# EAGLE design amiketo (EAGLE 7.2.0)
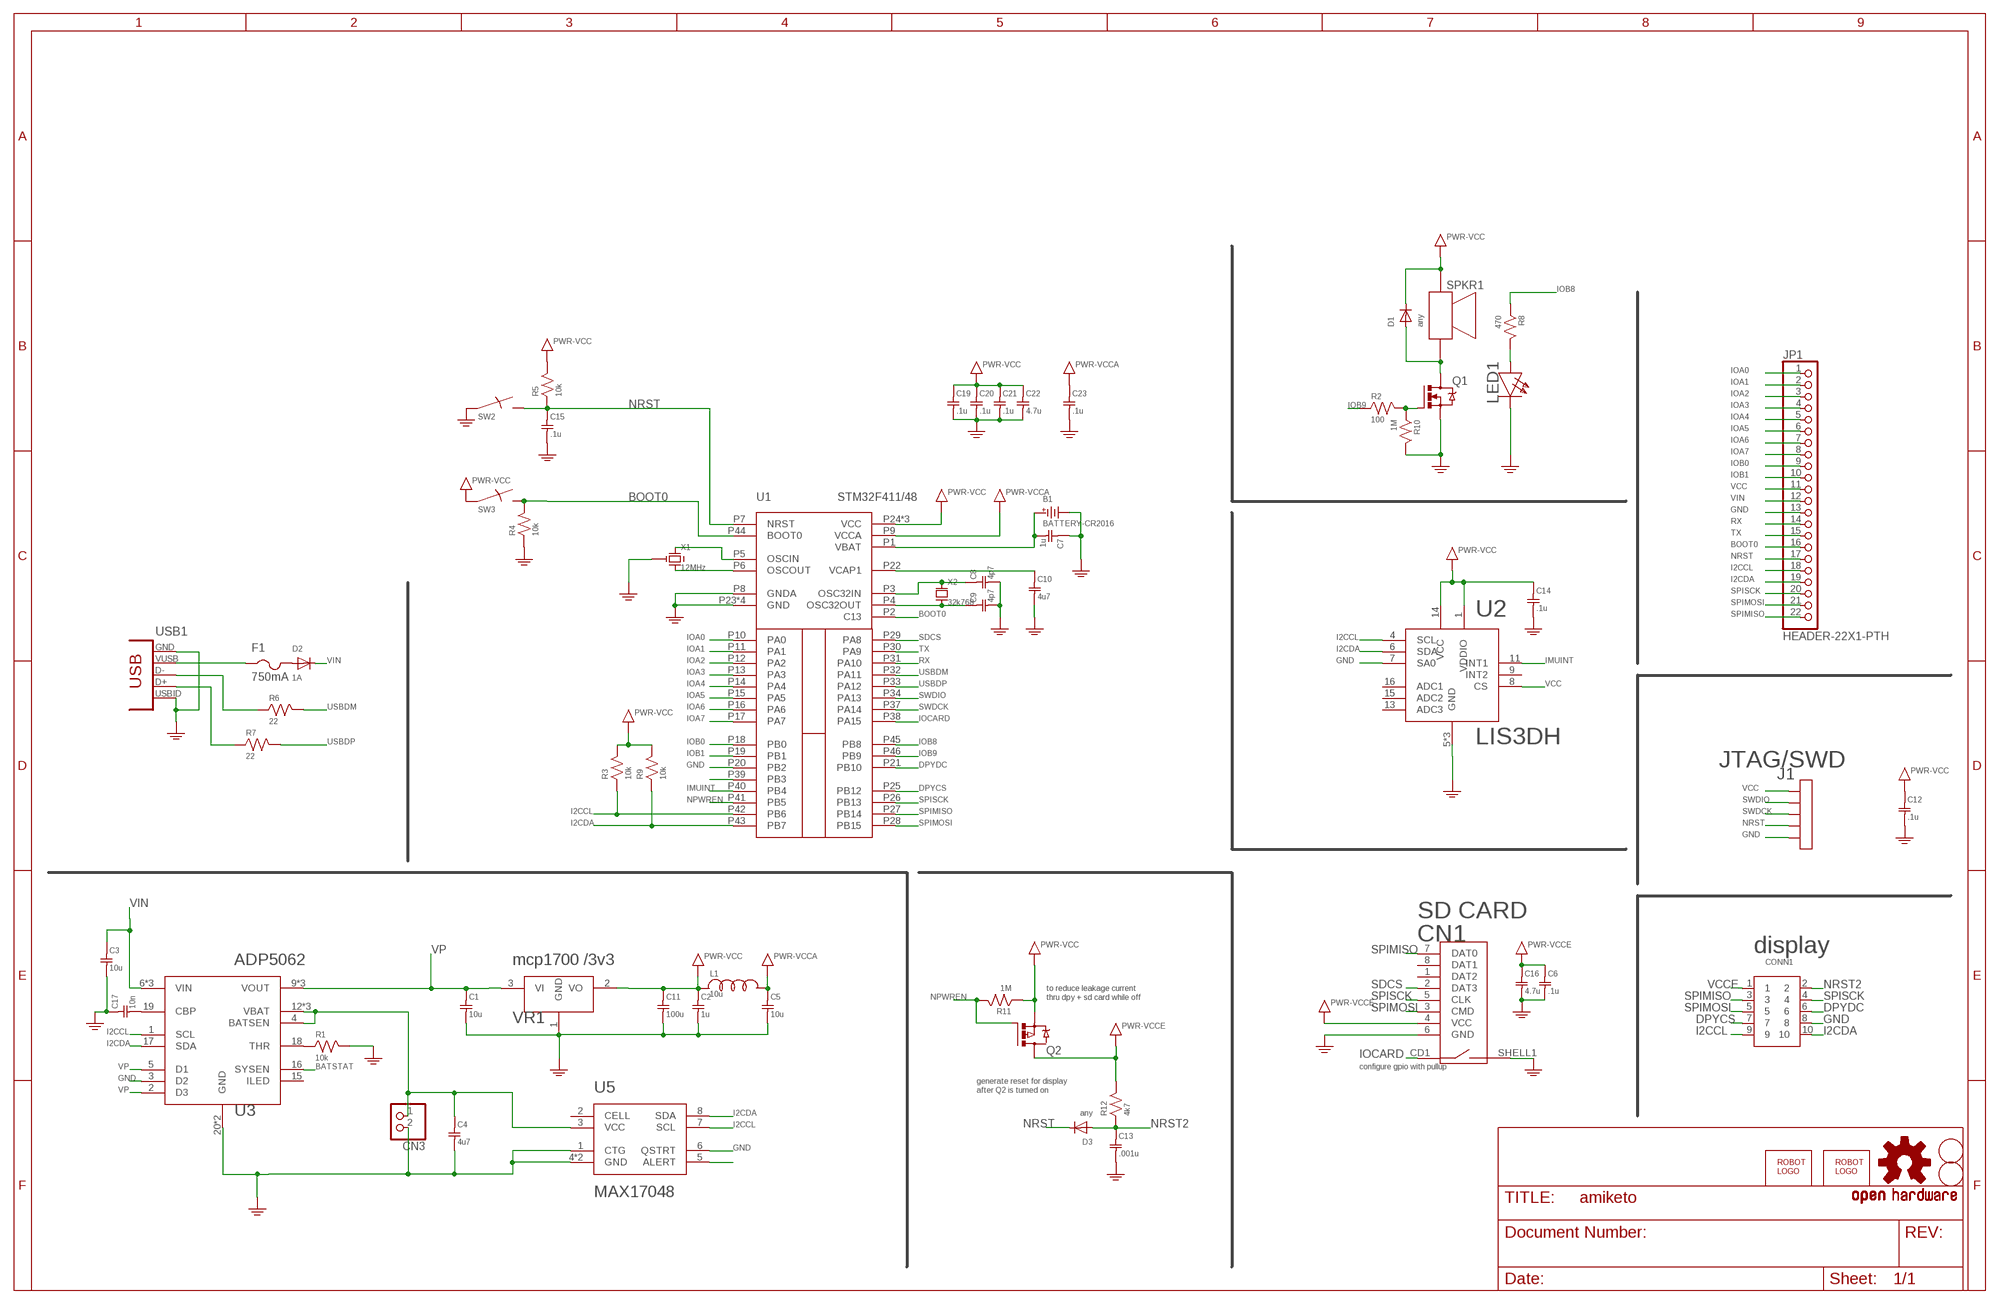
[diagram p0: schematic, sheet 1]

## Parts
B1  BATTERY-CR2016  [CR1216]
C1  10u  C0603  [SMD0603]
C2  1u  C0603  [SMD0603]
C3  10u  C0603  [SMD0603]
C4  4u7  C0603  [SMD0603]
C5  10u  C0603  [SMD0603]
C6  .1u  C0603  [SMD0603]
C7  1u  C0603  [SMD0603]
C8  4p7  C0603  [SMD0603]
C9  4p7  C0603  [SMD0603]
C10  4u7  C0603  [SMD0603]
C11  100u  C1210  [SMD1210]
C12  .1u  C0603  [SMD0603]
C13  .001u  C0603  [SMD0603]
C14  .1u  C0603  [SMD0603]
C15  .1u  C0603  [SMD0603]
C16  4.7u  C0603  [SMD0603]
C17  10n  C0603  [SMD0603]
C19  .1u  C0603  [SMD0603]
C20  .1u  C0603  [SMD0603]
C21  .1u  C0603  [SMD0603]
C22  4.7u  C0603  [SMD0603]
C23  .1u  C0603  [SMD0603]
CN1  MICROSD-EJECT  [MICROSD/EJECTOR]
CN3  JST_2PIN-SMT-RA  [JST-PH-2-SMT-RA]
CONN1  HEADER-5X2-PTH  [HEADER-5X2-PTH]
D1  any  DIODESOD-323  [SOD-323]
D2  1A  DIODE-0805  [SMD0805D]
D3  any  DIODESOD-323  [SOD-323]
F1  750mA  FUSE  [SMD1206]
J1  HEADER-5X1  [HEADER-5X1-SMD127-NOCR]
JP1  HEADER-22X1-PTH  [HEADER-22X1-PTH]
L1  10u  LSMD0603  [SMD0603]
LED1  white  LED  [SMD0603D]
LOGO1  OSHW-LOGOM  [OSHW-LOGO-M]
Q1  IRLML6344TRPBF  MOSFETSOT-23  [SOT-23]
Q2  DMP2035U-7  MOSFET-P  [SOT-23]
R1  10k  R0603  [SMD0603]
R2  100  R0603  [SMD0603]
R3  10k  R0603  [SMD0603]
R4  10k  R0603  [SMD0603]
R5  10k  R0603  [SMD0603]
R6  22  R0603  [SMD0603]
R7  22  R0603  [SMD0603]
R8  470  R0603  [SMD0603]
R9  10k  R0603  [SMD0603]
R10  1M  R0603  [SMD0603]
R11  1M  R0603  [SMD0603]
R12  4k7  R0603  [SMD0603]
SPKR1  PUI-5040  [PUI-0540]
SW2  SWITCHKMR211  [KMR211]
SW3  SWITCHKMR211  [KMR211]
U1  STM32F411/48  [UQPFN48]
U2  LIS3DH  [LGA16A]
U3  ADP5062  [LGA20P]
U5  MAX17048  [TDFN8EP]
U$1  ROBOTMAN-LOGO2  [ROBOTMAN-LOGO2]
U$2  FIDUCIAL  [FIDUCIAL_1MM]
U$3  FIDUCIAL  [FIDUCIAL_1MM]
U$4  ROBOTMAN-LOGO2  [ROBOTMAN-LOGO2]
USB1  CON-USB-F-MICRO-B  [CONN_USB_MICRO-B]
VR1  mcp1700 /3v3  REGULATOR-SOT23-3  [SOT-23-3]
X1  12MHz  RESONATORCTCE  [RESONATOR-CSTCE]
X2  32k768  XTAL32X15  [XTAL-32X15]

## Nets
BATSTAT: U3.16(SYSEN)
BOOT0: JP1.16 R4.2 SW3.2 SW3.4 U1.P2(C13) U1.P44(BOOT0)
DPYCS: CONN1.7 U1.P25(PB12)
DPYDC: CONN1.6 U1.P21(PB10)
GND: B1.MINUS(M) C1.2 C2.2 C3.2 C4.2 C5.2 C6.2 C7.1 C8.2 C9.2 C10.2 C11.2 C12.2 C13.2 C14.2 C15.2 C16.2 C17.1 C19.2 C20.2 C21.2 C22.2 C23.2 CN1.6(GND) CN1.SHELL1(SW2) CN3.2 CONN1.8 J1.P$5 JP1.13 LED1.C Q1.2(S) R1.2 R4.1 R10.2 SW2.1 SW2.3 U1.P8(GNDA) U1.P20(PB2) U1.P23(GND) U1.P35(GND) U1.P47(GND) U1.PAD(GND) U2.5(GND) U2.7(SA0) U2.10(GND) U2.12(GND) U3.3(D2) U3.20(GND) U3.PAD(GND) U5.1(CTG) U5.4(GND) U5.6(QSTRT) U5.PAD(GND) USB1.P4(USBID) USB1.P5(GND) VR1.1(GND) X1.2(G) ; supply symbol labelled PWR-GND
I2CCL: CONN1.9 JP1.18 R3.1 U1.P42(PB6) U2.4(SCL) U3.1(SCL) U5.7(SCL)
I2CDA: CONN1.10 JP1.19 R9.1 U1.P43(PB7) U2.6(SDA) U3.17(SDA) U5.8(SDA)
IMUINT: U1.P40(PB4) U2.11(INT1)
IOA0: JP1.1 U1.P10(PA0)
IOA1: JP1.2 U1.P11(PA1)
IOA2: JP1.3 U1.P12(PA2)
IOA3: JP1.4 U1.P13(PA3)
IOA4: JP1.5 U1.P14(PA4)
IOA5: JP1.6 U1.P15(PA5)
IOA6: JP1.7 U1.P16(PA6)
IOA7: JP1.8 U1.P17(PA7)
IOB0: JP1.9 U1.P18(PB0)
IOB1: JP1.10 U1.P19(PB1)
IOB8: R8.1 U1.P45(PB8)
IOB9: R2.1 U1.P46(PB9)
IOCARD: CN1.CD1(SW1) U1.P38(PA15)
N$3: F1.1 USB1.P1(VUSB)
N$5: C17.2 U3.19(CBP)
N$6: R1.1 U3.18(THR)
N$7: R6.1 USB1.P2(D-)
N$8: R7.1 USB1.P3(D+)
N$9: Q1.1(G) R2.2 R10.1
N$11: LED1.A R8.2
N$12: U1.P5(OSCIN) X1.1(X1)
N$13: U1.P6(OSCOUT) X1.3(X2)
N$14: D1.A Q1.3(D) SPKR1.P2
N$15: C8.1 U1.P3(OSC32IN) X2.P$1
N$16: C9.1 U1.P4(OSC32OUT) X2.P$2
N$18: C10.1 U1.P22(VCAP1)
N$21: B1.PLUS1(P) B1.PLUS2(P) C7.2 U1.P1(VBAT)
N$22: U5.5(ALERT)
N$24: D2.A F1.2
NPWREN: Q2.1(G) R11.2 U1.P41(PB5)
NRST: C15.1 D3.C J1.P$4 JP1.17 R5.1 SW2.2 SW2.4 U1.P7(NRST)
NRST2: C13.1 CONN1.2 D3.A R12.1
RX: JP1.14 U1.P31(PA10)
SDCS: CN1.2(DAT3) U1.P29(PA8)
SPIMISO: CN1.7(DAT0) CONN1.3 JP1.22 U1.P27(PB14)
SPIMOSI: CN1.3(CMD) CONN1.5 JP1.21 U1.P28(PB15)
SPISCK: CN1.5(CLK) CONN1.4 JP1.20 U1.P26(PB13)
SWDCK: J1.P$3 U1.P37(PA14)
SWDIO: J1.P$2 U1.P34(PA13)
SWDWO: U1.P39(PB3)
TX: JP1.15 U1.P30(PA9)
USBDM: R6.2 U1.P32(PA11)
USBDP: R7.2 U1.P33(PA12)
VBAT: C4.1 CN3.1 U3.4(BATSEN) U3.12(VBAT) U3.13(VBAT) U3.14(VBAT) U5.3(VCC)
VCC: C2.1 C11.1 C12.1 C14.1 C19.1 C20.1 C21.1 C22.1 D1.C J1.P$1 JP1.11 L1.1 Q2.2(S) R3.2 R5.2 R9.2 R11.1 SPKR1.P1 SW3.1 SW3.3 U1.P24(VCC) U1.P36(VCC) U1.P48(VCC) U2.1(VDDIO) U2.8(CS) U2.14(VCC) VR1.2(VO) ; supply symbol labelled PWR-VCC
VCCA: C5.1 C23.1 L1.2 U1.P9(VCCA) ; supply symbol labelled PWR-VCCA
VCCE: C6.1 C16.1 CN1.4(VCC) CONN1.1 Q2.3(D) R12.2 ; supply symbol labelled PWR-VCCE
VIN: C3.1 D2.C JP1.12 U3.6(VIN) U3.7(VIN) U3.8(VIN)
VP: C1.1 U3.2(D3) U3.5(D1) U3.9(VOUT) U3.10(VOUT) U3.11(VOUT) VR1.3(VI)
Unconnected: CN1.1(DAT2) CN1.8(DAT1) U2.9(INT2) U2.13(ADC3) U2.15(ADC2) U2.16(ADC1) U3.15(ILED) U5.2(CELL) USB1.BODY@1(BODY) USB1.BODY@2(BODY) USB1.BODY@3(BODY) USB1.BODY@4(BODY)

## Notes on the sheet
- JTAG/SWD
- SD CARD
- display
- to reduce leakage current
  thru dpy + sd card while off
- configure gpio with pullup
- generate reset for display
  after Q2 is turned on

## Library data of the parts
B1 = jaw:BATTERY
C1-C17 C19-C23 = jaw:C
CN1 = jaw:MICROSD
CN3 = adafruit:JST_2PIN: JST 2-Pin Connectors of various flavors SMT-RA (S2B-PH-SM4) 4UConnector #17311 SMT (B2B-PH-SM4) THM-RA (S2B-PH) THM (B2B-PH)
CONN1 = jaw:HEADER-5X2
D1-D3 = jaw:DIODE
F1 = jaw:FUSE
J1 = jaw:HEADER-5X1
JP1 = jaw:HEADER-22X1
L1 = jaw:L
LED1 = jaw:LED
LOGO1 = Sparkfun-Aesthetics:OSHW-LOGO: Open Source Hardware Logo This logo indicates the piece of hardware it is found on incorporates a OSHW license and/or adheres to the definition of open source hardware found here: http://freedomdefined.org/OSHW
Q1 = jaw:MOSFET
Q2 = jaw:MOSFET-P
R1-R12 = jaw:R
SPKR1 = jaw:PUI-5040
SW2 SW3 = jaw:SWITCH
U1 = jaw:STM32F411/48
U2 = jaw:LIS3DH
U3 = jaw:ADP5062
U5 = jaw:MAX17048
U$1 U$4 = jaw:ROBOTMAN-LOGO
U$2 U$3 = adafruit:FIDUCIAL: For use by pick and place machines to calibrate the vision/machine, 1mm By microbuilder.eu
USB1 = dp_devices:CON-USB-F: USB Female connector
VR1 = jaw:REGULATOR
X1 = jaw:RESONATOR
X2 = jaw:XTAL

## Board
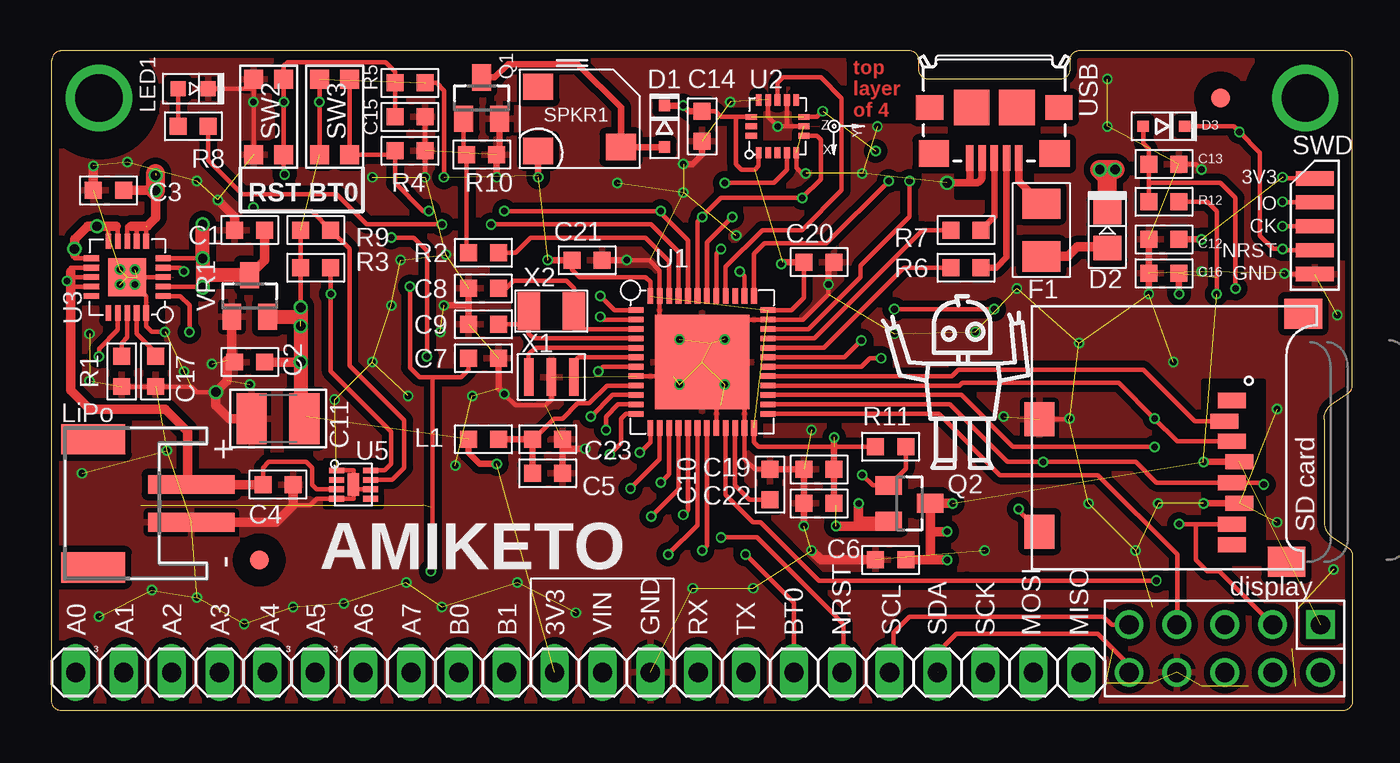
[diagram p1: board, top side]
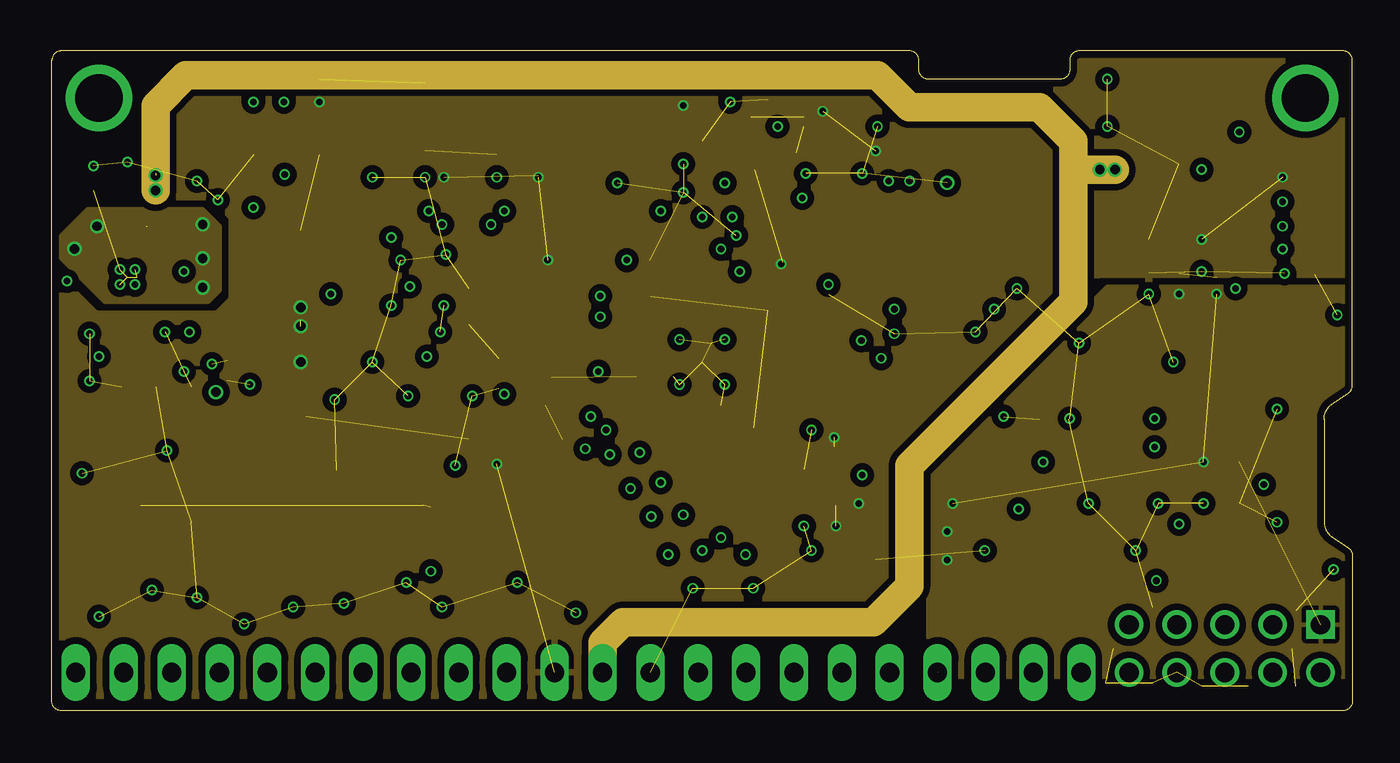
[diagram p2: board, inner layer V]
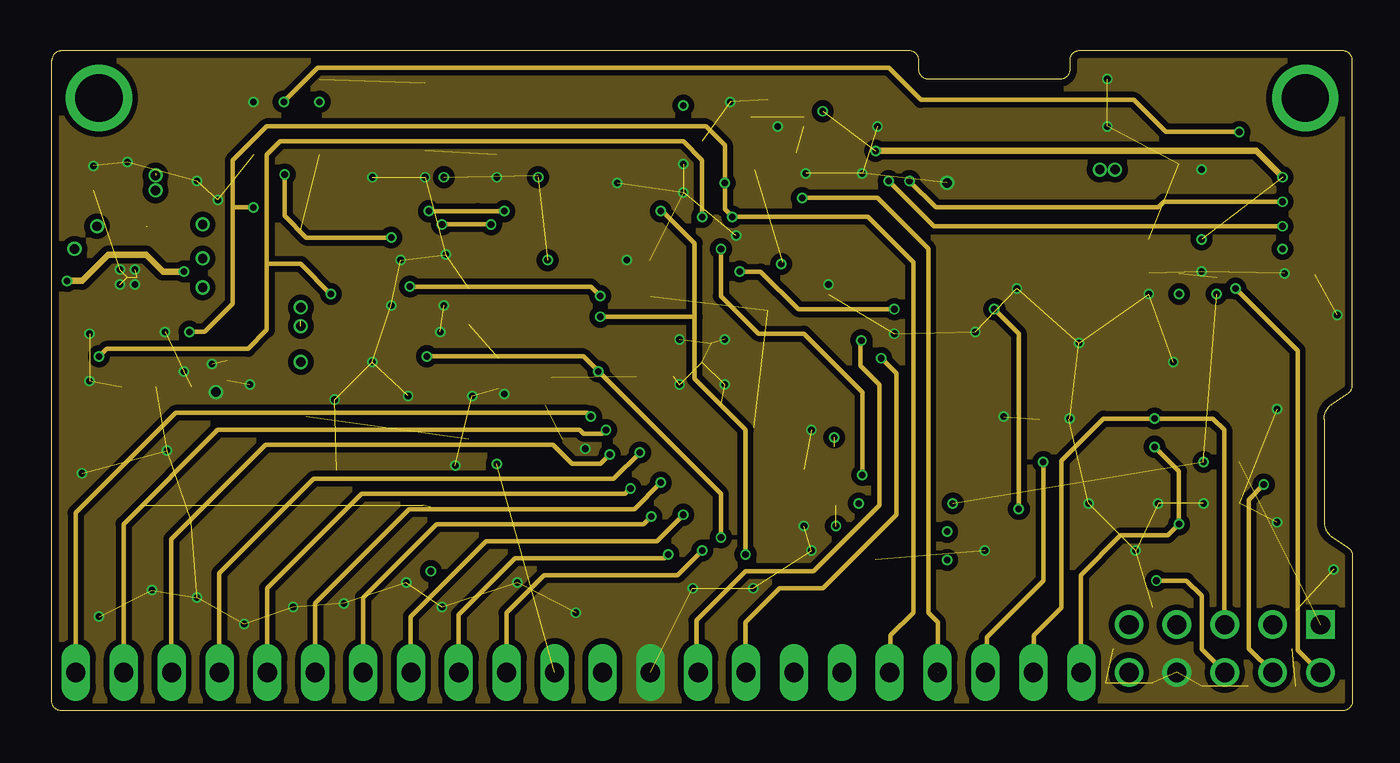
[diagram p3: board, inner layer Signal]
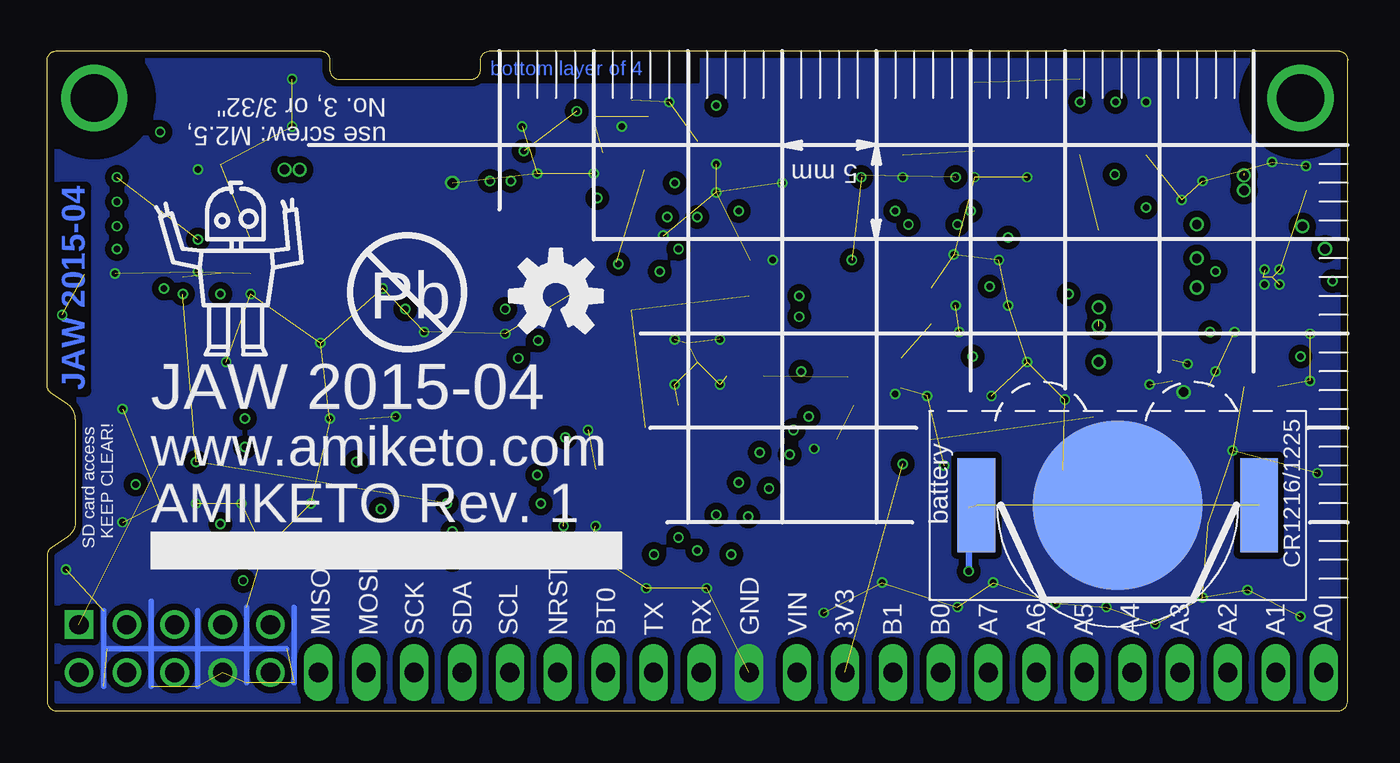
[diagram p4: board, bottom side, seen from below]

Size 69 x 35 mm. Coordinates in mm from the lower left corner, seen from the top.
Outline: 67.5,15.46 67.5,10.04 arc56 67.94,9.2 68.78,8.65 arc-56 69,8.23 69,0.5 arc-90 68.5,0 0.5,0 arc-90 0,0.5 0,34.5 arc-90 0.5,35 45.5,35 arc-90 46,34.5 46,34 arc90 46.5,33.5 53.5,33.5 arc90 54,34 54,34.5 arc-90 54.5,35 68.5,35 arc-90 69,34.5 69,17.27 arc-56 68.78,16.85 67.94,16.3 arc56 67.5,15.46
Copper layers (1*2*15*16): Top 0.035559375mm / dielectric 0.17018125mm / V 0.01778125mm / dielectric 47mil / Signal 0.01778125mm / dielectric 0.17018125mm / Bottom 0.035559375mm
Design rules "OSHPark-4layer *": minimum track width 5mil, minimum drill 10mil, track to track 6mil, track to pad 6mil, pad to pad 6mil, via to via 6mil, smd to smd 5mil, copper to edge 15mil, drill to drill 6mil, minimum pad ring 4mil, minimum via ring 4mil, stop-mask expansion 4mil, vias tented up to drill 0.52mm, thermal gap 10mil
tKeepout: area -0.4,29.6 to 5.4,35.4; area 63.6,29.6 to 69.4,35.4
tRestrict: area 63.6,29.6 to 69.4,35.4; area -0.4,29.6 to 5.4,35.4
bRestrict: area -0.4,29.6 to 5.4,35.4; area 63.6,29.6 to 69.4,35.4

### Footprints (pad centres in the part's own frame; a part is rotated, then mirrored left to right if it is on the bottom)
CR1216 = smd 9 x 9: MINUS 0,0 | smd 2 x 5: PLUS1 -7.5,0; PLUS2 7.5,0
SMD0603 = smd 0.9 x 0.9: 1 -0.8,0; 2 0.8,0
SMD1210 = smd 1.6 x 2.7: 1 -1.4,0; 2 1.4,0
MICROSD/EJECTOR = smd 0.8 x 1.5: 1 1.96,-3.1; 2 0.86,-2.7; 3 -0.2,-3.1; 4 -1.3,-3.5; 5 -2.4,-3.1; 6 -3.5,-3.5; 7 -4.6,-3.1; 8 -5.7,-3.1 | smd 1.8 x 1.6: CD1 -5,7.1; SHELL1 0.96,7.1 | smd 1.6 x 2: SHELL2 -6.6,-6; SHELL3 6.56,-6.9
JST-PH-2-SMT-RA = smd 1 x 4.6: 1 1,-3.7; 2 -1,-3.7 | smd 1.6 x 3.4: NC1 -3.4,1.5; NC2 3.4,1.5
HEADER-5X2-PTH = drill 1.016 square: 1 -5.08,-1.27 | drill 1.016: 2 -5.08,1.27; 3 -2.54,-1.27; 4 -2.54,1.27; 5 0,-1.27; 6 0,1.27; 7 2.54,-1.27; 8 2.54,1.27; 9 5.08,-1.27; 10 5.08,1.27
SOD-323 = smd 0.6 x 0.6: A 1.1,0; C -1.1,0
SMD0805D = smd 1.3 x 1.5: A 0.95,0; C -0.95,0
SMD1206 = smd 1.6 x 2: 1 -1.4,0; 2 1.4,0
HEADER-5X1-SMD127-NOCR = smd 0.762 x 2.032: P$1 -2.54,0; P$2 -1.27,0; P$3 0,0; P$4 1.27,0; P$5 2.54,0
HEADER-22X1-PTH = drill 1.016 long: 1 -25.4,0; 2 -22.86,0; 3 -20.32,0; 4 -17.78,0; 5 -15.24,0; 6 -12.7,0; 7 -10.16,0; 8 -7.62,0; 9 -5.08,0; 10 -2.54,0; 11 0,0; 12 2.54,0; 13 5.08,0; 14 7.62,0; 15 10.16,0; 16 12.7,0; 17 15.24,0; 18 17.78,0; 19 20.32,0; 20 22.86,0; 21 25.4,0; 22 27.94,0
SMD0603D = smd 0.8 x 0.8: A -0.8,0; C 0.8,0
SOT-23 = smd 1 x 1.4: 1 -0.95,-1.1; 2 0.95,-1.1; 3 0,1.1
PUI-0540 = smd 1.4 x 1.6: NC 1.8,2.2; P1 -1.6,2.2; P2 -1.4,-2.2
KMR211 = smd 1 x 1: 1 -2,0.8; 2 -2,-0.8; 3 2,0.8; 4 2,-0.8
UQPFN48 = smd 0.3 x 0.8: P1 -2.75,-3.5; P2 -2.25,-3.5; P3 -1.75,-3.5; P4 -1.25,-3.5; P5 -0.75,-3.5; P6 -0.25,-3.5; P7 0.25,-3.5; P8 0.75,-3.5; P9 1.25,-3.5; P10 1.75,-3.5; P11 2.25,-3.5; P12 2.75,-3.5; P25 2.75,3.5; P26 2.25,3.5; P27 1.75,3.5; P28 1.25,3.5; P29 0.75,3.5; P30 0.25,3.5; P31 -0.25,3.5; P32 -0.75,3.5; P33 -1.25,3.5; P34 -1.75,3.5; P35 -2.25,3.5; P36 -2.75,3.5 | smd 0.8 x 0.3: P13 3.5,-2.75; P14 3.5,-2.25; P15 3.5,-1.75; P16 3.5,-1.25; P17 3.5,-0.75; P18 3.5,-0.25; P19 3.5,0.25; P20 3.5,0.75; P21 3.5,1.25; P22 3.5,1.75; P23 3.5,2.25; P24 3.5,2.75; P37 -3.5,2.75; P38 -3.5,2.25; P39 -3.5,1.75; P40 -3.5,1.25; P41 -3.5,0.75; P42 -3.5,0.25; P43 -3.5,-0.25; P44 -3.5,-0.75; P45 -3.5,-1.25; P46 -3.5,-1.75; P47 -3.5,-2.25; P48 -3.5,-2.75 | smd 5 x 5: PAD 0,0
LGA16A = smd 0.3 x 0.6: 1 -1,-1.4; 2 -0.5,-1.4; 3 0,-1.4; 4 0.5,-1.4; 5 1,-1.4; 9 1,1.4; 10 0.5,1.4; 11 0,1.4; 12 -0.5,1.4; 13 -1,1.4 | smd 0.6 x 0.3: 6 1.4,-0.5; 7 1.4,0; 8 1.4,0.5; 14 -1.4,0.5; 15 -1.4,0; 16 -1.4,-0.5
LGA20P = smd 0.3 x 0.8: 1 -1,-1.9; 2 -0.5,-1.9; 3 0,-1.9; 4 0.5,-1.9; 5 1,-1.9; 11 1,1.9; 12 0.5,1.9; 13 0,1.9; 14 -0.5,1.9; 15 -1,1.9 | smd 0.8 x 0.3: 6 1.9,-1; 7 1.9,-0.5; 8 1.9,0; 9 1.9,0.5; 10 1.9,1; 16 -1.9,1; 17 -1.9,0.5; 18 -1.9,0; 19 -1.9,-0.5; 20 -1.9,-1 | smd 2 x 2: PAD 0,0
TDFN8EP = smd 0.3 x 0.8: 1 -0.75,-0.9; 2 -0.25,-0.9; 3 0.25,-0.9; 4 0.75,-0.9; 5 0.75,0.9; 6 0.25,0.9; 7 -0.25,0.9; 8 -0.75,0.9 | smd 1.2 x 0.6: PAD 0,0
FIDUCIAL_1MM = smd 1 x 1: 1 0,0
CONN_USB_MICRO-B = smd 1.6 x 1.4: BODY@1 -3.2,2.45; BODY@2 3.2,2.45 | smd 1.45 x 1.3: BODY@3 3.425,0; BODY@6 -3.425,0 | smd 1.9 x 1.9: BODY@4 1.2,0; BODY@5 -1.2,0 | smd 0.4 x 1.35: P1 -1.3,2.675; P2 -0.65,2.675; P3 0,2.675; P4 0.65,2.675; P5 1.3,2.675
SOT-23-3 = smd 1 x 1.4: 1 -0.95,-1.1; 2 0.95,-1.1; 3 0,1.1
RESONATOR-CSTCE = smd 0.5 x 2: 1 -1.2,0; 2 0,0; 3 1.2,0
XTAL-32X15 = smd 1.2 x 2: P$1 -1.2,0; P$2 1.2,0

### Placement (x,y rotation side)
B1  12.2,10.9 0 bottom
C1  10.5,25.5 180 top
C2  10.5,18.5 180 top
C3  3,27.6 180 top
C4  12,12 0 top
C5  26.3,12.6 0 top
C6  44.5,8 180 top
C7  22.9,18.7 180 top
C8  22.9,22.4 180 top
C9  22.9,20.5 180 top
C10  38.1,12 90 top
C11  12,15.5 180 top
C12  59,25 180 top
C13  59,29 0 top
C14  34.5,31 270 top
C15  19,31.5 0 top
C16  59,23.2 180 top
C17  5.5,18 90 top
C19  40.7,12.8 180 top
C20  40.7,23.8 0 top
C21  28.4,23.9 0 top
C22  40.7,11 180 top
C23  26.3,14.4 0 top
CN1  59.5,14.5 90 top
CN3  3.7,11 90 top
CONN1  62.23,3.3 180 top
D1  32.5,31 270 top
D2  56,25.5 270 top
D3  59,31 180 top
F1  52.5,25.5 270 top
J1  67,25.7 270 top
JP1  26.67,2.03 0 top
L1  22.9,14.4 0 top
LED1  7.5,33 0 top
LOGO1  42,22 0 bottom
Q1  22.8,32.5 0 top
Q2  45.5,11 270 top
R1  3.7,18 270 top
R2  22.9,24.3 180 top
R3  14,25.5 180 top
R4  19,29.7 180 top
R5  19,33.3 0 top
R6  48.5,23.5 180 top
R7  48.5,25.5 180 top
R8  7.5,31 180 top
R9  14,23.5 180 top
R10  22.8,29.5 0 top
R11  44.5,14 0 top
R12  59,27 0 top
SPKR1  28,31.3 90 top
SW2  11.5,31.5 90 top
SW3  15,31.5 90 top
U1  34.5,18.5 270 top
U2  38.5,31 0 top
U3  4,23 90 top
U5  16,12 270 top
U$1  48.3,17.3 0 top
U$2  62,32.5 0 top
U$3  11,8 0 top
U$4  59,23.3 0 bottom
USB1  50,32 180 top
VR1  10.5,22 0 top
X1  26.5,17.7 0 top
X2  26.5,21.2 180 top

### Tracks (layer width: path | path; a pad name or v marks a point on that pad's centre or on a via)
BOOT0  (via drill 0.35)
  Top 0.25: 18,29.5 SW3.2 SW3.4 | R4.2 18.2,28 19.7,26.5 v20,26.5 | U1.P44 33.75,24.95 32.2,26.5 v32.3,26.5 v24,26.5 | U1.P2 29.25,20.75 v29.1,20.9 | v36.8,8.3 39.36,5.74 39.36,2.04 JP1.16
  Top 0.35: 18,29.5 R4.2 | 36.83,8.27 v36.8,8.3
  Signal 0.25: v20,26.5 22.6,26.5 v24,26.5 | v36.8,8.3 36.8,14.9 34.1,17.6 34.1,20.9 | 34.1,20.9 34.1,24.8 32.4,26.5 v32.3,26.5 | v29.1,20.9 34.1,20.9
DPYCS
  Top 0.25: U1.P25 47.05,15.75 50.3,12.5 55.5,12.5 59.7,8.3 59.7,4.58 CONN1.7
DPYDC  (via drill 0.35)
  Top 0.25: U1.P21 35.75,11.45 37.2,10 37.6,10 40.7,6.9 48.5,6.9 48.6,6.9 v58.6,6.9
  Signal 0.25: v58.6,6.9 60.2,6.9 61,6.1 61,3.4 61,3.26 CONN1.6
GND  (via drill 0.35, 0.5)  (96 unrouted)
  Top 0.25: SW2.3 10.7,33 | 10.7,33 v10.7,32.3 SW2.1 | C15.2 R4.1 v19.8,28.3 | LED1.C 10.7,33 | U1.P8 32.95,17.75 | v30.5,23.9 31.7,23.9 32.25,23.35 U1.P47 32.25,20.75 v33.3,19.7 | v41.2,22.6 41.2,22.1 39.85,20.75 U1.P35 36.75,20.75 35,19.5 | C10.2 37.3,12.8 36.75,13.35 U1.P23 36.75,16.15 36.5,16.2 36,16.2 35.5,16.2 35.25,16.15 U1.P20 | U3.3 4.5,23 v4.4,22.6 5,22 U3.20 5,20.4 5.3,20.1 v6,20.1 | X1.2 26.5,16.5 26.2,16.2 24.6,16.2 v24,16.8 | 12.8,10.9 13.7,10.9 14.05,11.25 U5.4 16,11.25 U5.PAD | U5.1 16,12.75 U5.PAD | U5.6 16.25,11.75 U5.PAD | U2.5 39.5,28.8 39.8,28.5 v40,28.5 | U2.7 39,31 | 39,31 v38.5,31 38,31.5 U2.12 | U2.10 39,31 | J1.P$5 65.44,23.16 v65.4,23.2 | CN1.SHELL1 53.96,15.46 v54,15.5 | 23.75,29.65 R10.2 | R1.2 C17.1 7.4,17.2 7.7,16.9 v8.7,16.9 | C13.2 60.7,29 v61,28.7
  Top 0.35: C9.2 22.1,21.5 | 22.1,21.5 C8.2 | v20.8,21.5 22.1,21.5 | C23.2 27.1,13.9 | 27.1,13.9 C5.2 | v28.3,13.9 27.1,13.9 | C21.2 v30.5,23.9 | v41.2,22.6 41.2,23.8 C20.2 | C10.2 C19.2 C22.2 39.9,10.6 v39.9,9.8 | CN1.6 v61.1,11 | C14.2 34.5,29.5 34,29 v33.5,29 | v58.2,22.1 C16.2 C12.2 | C7.1 23.7,17.1 v24,16.8 | Q1.2 23.75,29.65 | R10.2 v23.6,28.3
  Top 0.4: USB1.P4 49.35,28.35 arc-90 49,28 48.7,28 | 48.7,28 v47.5,28 | USB1.P5 48.7,28
  Top 0.5: CN3.2 11.9,10 12.8,10.9 C4.2 | C3.2 v2.2,28.9 | C11.2 9.4,15.5 8.7,16.2 v8.7,16.9 9.3,17.5 9.3,18.6 | 9.3,18.6 9.4,18.5 C2.2 9.55,18.65 VR1.1 | 9.3,18.6 9.5,18.6 | C6.2 40.8,8 v40.3,8.5 | C1.2 9.7,26.2 v8.8,27.1
  Bottom 0.3: 65.8,3.3 56.3,3.3 | 55.9,1.5 55.9,5.5 | 58.4,1.5 58.4,5.5 | 61,1.3 61,5.3 | 63.48,5.8 63.48,1.3 | 66,1.3 66,5.3
  other vias: 33.3,17.3 43,28.5 24.7,6.8 20.7,5.5 18.8,6.8 8.5,18.4 10.2,4.6 7.7,6 10.5,17.3 7.7,28.1 20.9,24.2 17,28.3 18.5,23.9 20.6,20.1 18.9,16.7 4,29.1 35.7,19.7 30,28 40.3,14.9 12.8,5.5 22.3,16.7 1.6,12.6 2.5,5 5.3,6.4 6.1,13.8 35.7,17.3 44.7,20 36,32.3 15,16.5 15.5,5.7 27.8,5.2 56,33.5 2,20 50.5,15.6 49,20.1 59.5,18.5 65,10 65,16 54.5,19.5 55,11 3.6,22.6 3.6,23.4 4.4,23.4 33.5,27.5 43.8,31 36.3,25.2 56,31 51.2,22.4 68.2,21 68,7.5 61,23.3 21.4,13 34,6.5 37.2,6.5 58.7,11 57.5,8.5 49.5,8.5 17,18.5 18,21.5 2,17.5 7,18
  pour Bottom (isolate 0.35, no thermals): 0,35.5 0,0 72,0 72,35.5
  pour Top (isolate 0.35): 0,35.5 0,0 72,0 72,35.5
  pour Signal (isolate 0.3, no thermals): 0,35.5 0,0 72,0 72,35.5
I2CCL  (via drill 0.35)
  Top 0.25: U1.P42 34.75,24.85 v36.1,26.2 | v7.3,20.1 7.3,21.5 6.8,22 U3.1 | U5.7 18.05,12.25 18.7,12.9 18.7,15.4 15.8,18.3 15.8,24.5 R3.1 13.8,26.5 10.9,26.5 v10.7,26.7 | U2.4 39,28.7 38.3,28 v35.7,28 | CONN1.9 56.23,4.57 55.8,5 45.5,5 44.65,4.15 44.65,2.23 JP1.18
  Signal 0.25: 9.6,26.7 9.6,29.2 11.4,31 34.7,31 35.7,30 v35.7,28 35.7,26.6 v36.1,26.2 43.3,26.2 45.7,23.8 45.7,5.2 44.5,4 44.5,2.08 JP1.18 | 9.6,26.7 9.6,21.6 8.1,20.1 v7.3,20.1 | v10.7,26.7 9.6,26.7
I2CDA  (via drill 0.35)  (1 unrouted)
  Top 0.25: U1.P43 34.25,25.95 v34.5,26.2 35.5,27.2 v39.8,27.2 40.8,28.2 40.8,30.3 40.6,30.5 U2.6 | U3.17 3.5,20.2 2.5,19.2 v2.5,18.8 | U5.8 17.65,12.75 18,13.1 18,14.8 14.8,18 v14.8,22.1 R9.1 | CONN1.10 57.15,2.45 55.5,4.1 48,4.1 47,3.1 47,2.04 JP1.19
  Signal 0.25: v39.8,27.2 43.8,27.2 46.5,24.5 46.5,5.2 47,4.7 47,2.05 | v34.5,26.2 34.5,29.2 33.5,30.2 12.1,30.2 11.4,29.5 11.4,23.7 | 11.4,23.7 11.4,20.2 10.4,19.2 2.9,19.2 v2.5,18.8 | 11.4,23.7 13.2,23.7 v14.8,22.1
IMUINT
  Top 0.25: U1.P40 35.75,23.55 37.7,25.5 39.8,25.5 41.9,27.6 41.9,32.5 40.8,33.6 38.8,33.6 38.5,33.3 U2.11
IOA0  (via drill 0.35)
  Top 0.25: U1.P10 29.75,16.75 v28.6,15.6
  Signal 0.25: v28.6,15.6 28.4,15.8 6.56,15.8 1.26,10.5 1.26,2.04 JP1.1
IOA1  (via drill 0.35)
  Top 0.25: U1.P11 30.05,16.25 29.4,15.6 v29.4,14.9
  Signal 0.25: v29.4,14.9 29.2,14.7 28.2,14.7 28,14.9 8.8,14.9 3.8,9.9 3.8,2.04 JP1.2
IOA2  (via drill 0.35)
  Top 0.25: U1.P12 30.45,15.75 30.2,15.5 30.2,14.2 v29.6,13.6
  Signal 0.25: v29.6,13.6 29.1,13.1 27.6,13.1 26.6,14.1 11.34,14.1 6.34,9.1 6.34,2.04 JP1.3
IOA3  (via drill 0.35)
  Top 0.25: U1.P13 31.75,14.25 v31.2,13.7
  Signal 0.25: v31.2,13.7 29.8,12.3 13.88,12.3 8.88,7.3 8.88,2.04 JP1.4
IOA4  (via drill 0.35)
  Top 0.25: U1.P14 32.25,13.35 v30.7,11.8
  Signal 0.25: v30.7,11.8 30.4,11.5 16.42,11.5 11.42,6.5 11.42,2.04 JP1.5
IOA5  (via drill 0.35)
  Top 0.25: U1.P15 32.75,12.55 v32.3,12.1
  Signal 0.25: v32.3,12.1 30.9,10.7 18.96,10.7 13.96,5.7 13.96,2.04 JP1.6
IOA6  (via drill 0.35)
  Top 0.25: U1.P16 33.25,11.75 v31.8,10.3
  Signal 0.25: v31.8,10.3 31.4,9.9 20.4,9.9 16.5,6 16.5,2.04 JP1.7
IOA7  (via drill 0.35)
  Top 0.25: U1.P17 33.75,10.65 v33.5,10.4
  Signal 0.25: v33.5,10.4 32.1,9 23.04,9 19.04,5 19.04,2.04 JP1.8
IOB0  (via drill 0.35)
  Top 0.25: U1.P18 34.25,9.85 v32.7,8.3
  Signal 0.25: v32.7,8.3 32.5,8.1 24.58,8.1 21.58,5.1 21.58,2.04 JP1.9
IOB1  (via drill 0.35)
  Top 0.25: 34.55,8.55 v34.5,8.5 34.75,8.75 U1.P19
  Signal 0.25: v34.5,8.5 33.2,7.2 26.12,7.2 24.12,5.2 24.12,2.04 JP1.10
IOB8  (via drill 0.35)
  Top 0.25: R8.1 8.3,29.2 10.1,27.4 15.1,27.4 16.7,25.8 v20.7,25.8 | U1.P45 33.25,24.35 31.8,25.8 30.7,25.8 v23.3,25.8
  Signal 0.25: v23.3,25.8 v20.7,25.8
IOB9
  Top 0.25: U1.P46 32.75,23.85 31.8,24.8 31.5,25.1 25.4,25.1 24.6,24.3 R2.1
IOCARD  (via drill 0.35)
  Top 0.25: v44.7,21.3 v50,21.3 | U1.P38 36.75,23.05 v36.5,23.3 | v51.3,10.7 51.3,10.6 CN1.CD1
  Signal 0.25: v36.5,23.3 37.6,23.3 39.6,21.3 v44.7,21.3 | v50,21.3 51.3,20 v51.3,10.7
N$1
  cutout Top: 39.5,29.9 39.5,28.8 40.3,28.8 40.3,29.9
N$2
  cutout Top: 48,30 48,27.2 52,27.2 52,30
N$3
  Top 0.4: USB1.P1 51.3,28.12 51.3,28.1 F1.1
N$4
  cutout Top: 4.9,21.5 4.9,20 5.9,20 5.9,21.5
N$5
  Top 0.25: U3.19 4.5,20 5.5,19 C17.2
N$6
  Top 0.25: U3.18 4,19.8 3.7,19.5 R1.1
N$7
  Top 0.35: USB1.P2 50.65,24.05 50.1,23.5 R6.1
N$8
  Top 0.35: USB1.P3 50,26.2 R7.1
N$9
  Top 0.25: Q1.1 21.85,29.65 R10.1 22,27.9 22,24.4 R2.2
N$10
  cutout Top: 61.1,17.5 61.1,7.8 64.3,7.8 64.3,17.5
N$11
  Top 0.25: LED1.A R8.2
N$12
  Top 0.25: U1.P5 29.45,19.25 25.65,19.25 25.3,18.9 X1.1
N$13
  Top 0.25: U1.P6 29.55,18.75 29.35,18.75 27.95,18.75 27.7,18.5 X1.3
N$14
  Top 0.35: D1.A 30.6,29.9 SPKR1.P2 30.2,32 27.9,34.3 24.2,34.3 23.5,33.6 Q1.3
N$15
  Top 0.25: U1.P3 28.65,20.25 27.75,20.25 27.7,20.3 X2.P$1 27.7,22 27.7,22.4 27.3,22.8 26.9,22.8 24.5,22.8 24.1,22.4 C8.1
N$16
  Top 0.25: U1.P4 26.75,19.75 25.55,19.75 25.3,20 25.3,20.5 | C9.1 25.3,20.5 | 25.3,20.5 X2.P$2
N$18
  Top 0.25: U1.P22 36.25,11.95 37,11.2 C10.1
N$20  (via drill 2.5)
  other vias: 2.5,32.5
N$21  (via drill 0.35)  (2 unrouted)
  Top 0.25: U1.P1 29.85,21.25 v29.1,22 | v19,22.5 19,18.2 19.5,17.7 20.2,17.7 | 20.2,17.7 20.2,7.5 v20.1,7.4 | 20.2,17.7 21.7,17.7 22.1,18.1 C7.2
  Top 0.35: C7.2 21.9,18.7
  Signal 0.25: v29.1,22 28.6,22.5 v19,22.5
  Bottom 0.35: v20.1,7.4 20.1,10.8
N$23  (via drill 2.5)
  other vias: 66.5,32.5
N$24
  Top 0.5: F1.2 53.9,24.1 54.4,24.6 55.95,24.6 D2.A
N$25
  cutout Bottom: 34.5,34.8 46,34.8 46,33.4 34.5,33.4
N$26
  cutout Top: 2.5,24.2 3.1,24.2 3.1,21.8 2.5,21.8
  cutout Top: 4.9,24.2 5.5,24.2 5.5,21.8 4.9,21.8
N$27
  cutout Top: 3.1,24.4 5,24.4 5,23.9 3.1,23.9
  cutout Top: 3.1,22.1 5,22.1 5,21.6 3.1,21.6
N$28
  cutout Top: 14.5,13.3 17.5,13.3 17.5,10.8 14.5,10.8
NPWREN  (via drill 0.35)
  Top 0.25: U1.P41 35.25,24.25 v35.5,24.5 | v43,12.5 43.55,11.95 Q2.1 45.3,12.85 R11.2
  Signal 0.25: v43,12.5 43,16.9 39.9,20 37.5,20 35.5,22 v35.5,24.5
NRST  (via drill 0.35)
  Top 0.25: C15.1 R5.1 18.2,33.9 17.7,34.4 12.5,34.4 12.3,34.2 SW2.4 v12.3,32.3 SW2.2 12.3,28.4 | v18,25.1 19.2,25.1 19.9,24.4 v19.9,18.8 | U1.P7 29.25,18.25 v29,18 | v35.5,9.2 37.4,9.2 41.25,5.35 42,4.6 42,2.12 JP1.17 | J1.P$4 65.37,24.43 v65.3,24.5 64.8,24.5 64.1,25.2 64.1,29.6 v63,30.7 62.7,31 D3.C
  Top 0.35: R5.1 18.2,33.2 | 12.3,28.4 v12.35,28.45
  Signal 0.25: v19.9,18.8 28.2,18.8 v29,18 35.5,11.5 v35.5,9.2 | v12.35,28.45 12.35,26.25 13.5,25.1 v18,25.1 | v63,30.7 59.1,30.7 57.4,32.4 46.1,32.4 44.4,34.1 14.1,34.1 v12.3,32.3
NRST2  (via drill 0.35)
  Top 0.25: D3.A 57.9,30.1 58.2,29.8 C13.1 58.2,27.9 | 58.2,27.9 R12.1 | v62.8,22.4 62.8,27.2 62,28 58.3,28 58.2,27.9
  Signal 0.25: CONN1.2 67.27,2.03 66.1,3.2 66.1,19.1 v62.8,22.4
RX  (via drill 0.35)
  Top 0.25: U1.P31 42.05,18.75 42.85,19.55 v42.95,19.65 43,19.7
  Top 0.35: v42.95,19.65 42.85,19.55
  Signal 0.25: 42.9,19.6 42.9,18.3 43.9,17.3 43.9,10.9 40.4,7.4 36.8,7.4 34.2,4.8 34.2,2.12 JP1.14
  Signal 0.35: 42.9,19.6 v42.95,19.65
SDCS
  Top 0.25: U1.P29 47.75,17.75 48.1,18.1 49.4,18.1 57.9,18.1 60.64,15.36 CN1.2
SPIMISO  (via drill 0.35)
  Top 0.25: U1.P27 48.25,16.75 51,14 v58.5,14 | CN1.7 60.7,9.9 | 60.7,9.9 v59.8,9.9 | CONN1.3 61.94,7.4 61.3,7.4 60.7,8 60.7,9.9
  Signal 0.25: v58.5,14 59.8,12.7 v59.8,9.9 59.2,9.3 56.7,9.3 54.6,7.2 54.6,2.04 JP1.22
SPIMOSI  (via drill 0.35)
  Top 0.25: U1.P28 48.15,17.25 48.3,17.4 56.6,17.4 v58.5,15.5 59.7,14.3 CN1.3
  Signal 0.25: CONN1.5 62.2,4.6 62.2,4.88 62.2,14.9 61.6,15.5 v58.5,15.5 55.8,15.5 53.56,13.26 53.56,5.46 52.1,4 52.1,2.06 JP1.21
SPISCK  (via drill 0.35)
  Top 0.25: U1.P26 47.65,16.25 50.7,13.2 v52.6,13.2 57.5,13.2 58.6,12.1 CN1.5 64.2,12.1 v64.3,12.01
  Signal 0.25: v52.6,13.2 52.6,6.9 49.6,3.9 49.6,2.1 JP1.20 | CONN1.4 63.5,3.3 63.5,3.46 63.5,11.1 63.5,11.21 v64.3,12.01
SWDCK  (via drill 0.35)
  Top 0.25: U1.P37 37.25,24.25 37.8,24.8 41.1,24.8 v44.4,28.1 | J1.P$3 v65.3,25.7
  Signal 0.25: v44.4,28.1 46.8,25.7 v65.3,25.7
SWDIO  (via drill 0.35)
  Top 0.25: U1.P34 40.15,20.25 42.9,23 42.9,23.6 45.5,26.2 v45.5,28.1 | J1.P$2 65.33,26.97 v65.3,27
  Signal 0.25: v45.5,28.1 46.9,26.7 58.7,26.7 59,27 v65.3,27
TX  (via drill 0.35)
  Top 0.25: U1.P30 42.95,18.25 43.4,18.7 v44,18.7
  Signal 0.25: v44,18.7 44.8,17.9 44.8,10.4 40.9,6.5 38.6,6.5 36.8,4.7 36.8,2.06 JP1.15
USBDM
  Top 0.25: U1.P32 40.95,19.25 45.2,23.5 R6.2
USBDP
  Top 0.25: U1.P33 40.45,19.75 46.2,25.5 R7.2
VBAT  (via drill 0.35)
  Top 0.25: U3.12 1,23.5 1,23.3 | U3.13 1,23 | U3.14 1,22.5 | U3.4 6.8,23.5 v7,23.3 | U5.3 14.05,11.75 13.8,12 13.8,12.9 13.5,13.2 11.5,13.2 11.2,12.9 C4.1
  Top 0.35: v0.8,22.8 1,22.8
  Top 0.5: C4.1 CN3.1 7,12 | 6,12.2 6.2,12 7,12 | 7,12 7.2,12.2 7.2,14.8 6,16 2,16 1,17 1,22.5 1,22.8 | 1,22.8 1,23 | 1,23.3 1,22.8
  Signal 0.35: v7,23.3 5.9,23.3 5,24.2 3,24.2 1.6,22.8 v0.8,22.8
VCC  (via drill 0.35, 0.5)  (15 unrouted)
  Top 0.25: SW3.3 v14.2,32.3 SW3.1 | U1.P48 31.75,22.75 31.5,23 28,23 27.6,23.4 C21.1 | U1.P36 39.25,21.25 39.9,21.9 C20.1 | U1.P24 37.25,14.25 37.5,14 41.5,14 R11.1 | U2.14 36.3,31.5 | 36.3,31.5 35.5,31.5 35.2,31.8 C14.1 | U2.1 37.5,28.9 37.3,28.7 36.6,28.7 36.3,29 36.3,31.5 | U2.8 40.6,31.5 v40.9,31.8 | R3.2 R9.2 v13.2,21.4 | J1.P$1 65.36,28.24 v65.3,28.3 | R5.2 20.4,33.3 20.8,32.9 v20.8,28.3
  Top 0.35: SPKR1.P1 25.8,28.4 v25.8,28.3 | D1.C v33.5,32.1 33.8,31.8 C14.1 | C21.1 v26.3,23.9 | C20.1 38.8,23.8 v38.7,23.7 | L1.1 22.1,13.7 22.7,13.1 v23.6,13.1 | 41.6,10.9 arc90 C22.1 C19.1 v41.5,14.5 | C12.1 v61,25
  Top 0.5: 12.9,16 C11.1 13.5,15.6 13.2,15.6 | C2.1 v13.2,18.5 | 13.2,20.9 13.2,20.7 | v42.8,11 42.8,10.05 Q2.2 44.4,9.8 v41.6,9.8
  Top 0.75: 13.2,15.6 v13.2,18.5 13.2,20.7 | v13.2,21.4 13.2,20.9 VR1.2
  Signal 0.35: v65.3,28.3 63.9,29.7 v43.7,29.7
  other vias: 13.2,20.4
  pour V (isolate 0.35, rank 3): 0,35.5 0,0.8 72,0.8 72,35.5
VCCA
  Top 0.25: U1.P9 29.45,17.25 28.5,16.3 27.9,16.3 27.1,15.5 26.65,15.5 25.55,14.4 C23.1
  Top 0.35: L1.2 C23.1 C5.1
VCCE  (via drill 0.35)  (4 unrouted)
  Top 0.25: R12.2 61.3,27 61.8,26.5 61.8,23 v61.8,22.1
  Top 0.35: C16.1 v59.8,22.1 | CN1.4 v61.1,13.2
  Top 0.5: 46.6,9.5 46.6,9.7 Q2.3 v47.8,11 | 46.6,9.5 46.6,8.4 46.6,8 | 46.8,8 v47.5,8 46.8,8 | 46.8,8 46.6,8 | 46.6,8 C6.1 | 46.6,8 46.8,8 | v47.5,9.5 46.6,9.5
  pour V (isolate 0.35): 56,22.5 73,22.5 73,1.8 46.5,1.8 46.5,13
VIN  (via drill 0.5)  (2 unrouted)
  Top 0.25: U3.6 5,25.7 | U3.7 4.5,25.7 | U3.8 4,25.7 4.2,25.7
  Top 0.5: C3.1 v5.5,27.6 5.5,26.15 5.05,25.7 | 5,25.7 4.5,25.7 4.2,25.7
  Top 1: v5.5,27.6 5.5,28.5 | 55.95,28.7 v55.6,28.7 | v56.4,28.7 55.95,28.7 | 55.95,28.7 v55.6,28.7 | D2.C 56,28.3 v55.6,28.7
  V 1.5: v5.5,27.6 5.5,32.1 7.1,33.7 43.8,33.7 45.5,32 52.4,32 54.2,30.2 54.2,28.7 | 54.2,28.7 54.2,21.7 45.5,13 45.5,6.6 43.6,4.7 30.3,4.7 29.21,3.61 JP1.12 | v56.4,28.7 54.2,28.7
  other vias: 5.5,28.4
VP  (via drill 0.5)
  Top 0.25: U3.11 1.2,24 1.2,24.2 | U3.9 3.5,25.7 3.4,25.7 | U3.10 3,25.7 | U3.5 7.7,24 v8,24 | U3.2 8,22.5 8.2,22.5 v8,22.45
  Top 0.5: 3.4,25.7 3,25.7 v2.4,25.7 1.9,25.7 1.2,25 v1.2,24.5 1.2,24.2 | v8,24 8,23.1 | C1.1 11.3,23.9 VR1.3
  Top 0.75: 8,23.1 8,22.5 | v8,25.8 v8,24 8,23.1 | VR1.3 8,23.1
  pour V (isolate 0.35, rank 2): 1.9,26.6 8,26.6 8.9,25.7 8.9,22.3 8.3,21.7 2.8,21.7 0.5,24 0.5,25.2

### Text on the board
Top: top / layer / of 4
Bottom: bottom layer of 4 | JAW 2015-04
tPlace: USB | Z | X | Y | SWD | 3V3 | RST | BT0 | IO | CK | NRST | GND | LiPo | SD card | AMIKETO | display | A0 | A1 | A2 | A3 | A4 | A5 | A6 | A7 | B0 | B1 | 3V3 | VIN | GND | RX | TX | BT0 | NRST | SCL | SDA | SCK | MOSI | MISO | 3 | 3 | 3
bPlace: use screw: M2.5, / No. 3, or 3/32" | 5 mm | Pb | CR1216/1225 | JAW 2015-04 | battery | www.amiketo.com | AMIKETO Rev. 1 | SD card access / KEEP CLEAR! | A0 | A1 | A2 | A3 | A4 | A5 | A6 | A7 | B0 | B1 | 3V3 | VIN | GND | RX | TX | BT0 | NRST | SCL | SDA | SCK | MOSI | MISO
bStop: JAW 2015-04